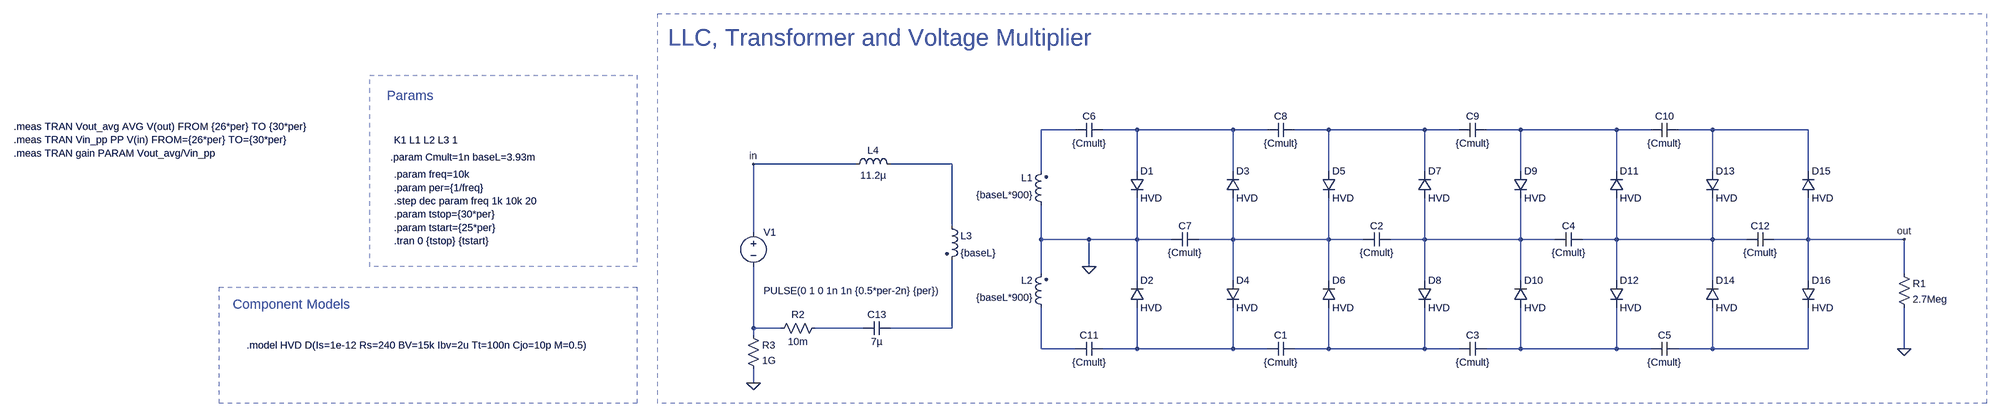
[diagram p0: schematic LLC_Multiplier.asc]
LLC_Multiplier.asc, the LTspice schematic file:
Version 4.1
SHEET 1 1636 1108
WIRE -496 -16 -576 -16
WIRE -352 -16 -432 -16
WIRE -128 -16 -352 -16
WIRE -48 -16 -128 -16
WIRE 96 -16 16 -16
WIRE 320 -16 96 -16
WIRE 400 -16 320 -16
WIRE 544 -16 464 -16
WIRE 768 -16 544 -16
WIRE 848 -16 768 -16
WIRE 992 -16 912 -16
WIRE 1216 -16 992 -16
WIRE -1008 64 -1248 64
WIRE -784 64 -928 64
WIRE -576 80 -576 -16
WIRE -352 80 -352 -16
WIRE -128 80 -128 -16
WIRE 96 80 96 -16
WIRE 320 80 320 -16
WIRE 544 80 544 -16
WIRE 768 80 768 -16
WIRE 992 80 992 -16
WIRE 1216 80 1216 -16
WIRE -784 208 -784 64
WIRE -1248 224 -1248 64
WIRE -576 240 -576 160
WIRE -464 240 -576 240
WIRE -352 240 -352 144
WIRE -352 240 -464 240
WIRE -272 240 -352 240
WIRE -128 240 -128 144
WIRE -128 240 -208 240
WIRE 96 240 96 144
WIRE 96 240 -128 240
WIRE 176 240 96 240
WIRE 320 240 320 144
WIRE 320 240 240 240
WIRE 544 240 544 144
WIRE 544 240 320 240
WIRE 624 240 544 240
WIRE 768 240 768 144
WIRE 768 240 688 240
WIRE 992 240 992 144
WIRE 992 240 768 240
WIRE 1072 240 992 240
WIRE 1216 240 1216 144
WIRE 1216 240 1136 240
WIRE 1440 240 1216 240
WIRE -464 304 -464 240
WIRE -576 320 -576 240
WIRE 1440 320 1440 240
WIRE -352 336 -352 240
WIRE -128 336 -128 240
WIRE 96 336 96 240
WIRE 320 336 320 240
WIRE 544 336 544 240
WIRE 768 336 768 240
WIRE 992 336 992 240
WIRE 1216 336 1216 240
WIRE -1248 448 -1248 304
WIRE -1184 448 -1248 448
WIRE -992 448 -1104 448
WIRE -784 448 -784 288
WIRE -784 448 -928 448
WIRE -1248 464 -1248 448
WIRE -576 496 -576 400
WIRE -496 496 -576 496
WIRE -352 496 -352 400
WIRE -352 496 -432 496
WIRE -128 496 -128 400
WIRE -128 496 -352 496
WIRE -48 496 -128 496
WIRE 96 496 96 400
WIRE 96 496 16 496
WIRE 320 496 320 400
WIRE 320 496 96 496
WIRE 400 496 320 496
WIRE 544 496 544 400
WIRE 544 496 464 496
WIRE 768 496 768 400
WIRE 768 496 544 496
WIRE 848 496 768 496
WIRE 992 496 992 400
WIRE 992 496 912 496
WIRE 1216 496 1216 400
WIRE 1216 496 992 496
WIRE 1440 496 1440 400
WIRE -1248 576 -1248 544
FLAG 1440 496 0
FLAG -464 304 0
FLAG -1248 64 in
FLAG 1440 240 out
FLAG -1248 576 0
SYMBOL cap 16 480 R90
WINDOW 0 0 32 VBottom 2
WINDOW 3 32 32 VTop 2
SYMATTR InstName C1
SYMATTR Value {Cmult}
SYMBOL cap 240 256 M270
WINDOW 0 32 32 VTop 2
WINDOW 3 0 32 VBottom 2
SYMATTR InstName C2
SYMATTR Value {Cmult}
SYMBOL cap 464 480 R90
WINDOW 0 0 32 VBottom 2
WINDOW 3 32 32 VTop 2
SYMATTR InstName C3
SYMATTR Value {Cmult}
SYMBOL res 1424 304 R0
SYMATTR InstName R1
SYMATTR Value 2.7Meg
SYMBOL cap 688 256 M270
WINDOW 0 32 32 VTop 2
WINDOW 3 0 32 VBottom 2
SYMATTR InstName C4
SYMATTR Value {Cmult}
SYMBOL cap 912 480 R90
WINDOW 0 0 32 VBottom 2
WINDOW 3 32 32 VTop 2
SYMATTR InstName C5
SYMATTR Value {Cmult}
SYMBOL cap -496 0 R270
WINDOW 0 32 32 VTop 2
WINDOW 3 0 32 VBottom 2
SYMATTR InstName C6
SYMATTR Value {Cmult}
SYMBOL cap -208 224 R90
WINDOW 0 0 32 VBottom 2
WINDOW 3 32 32 VTop 2
SYMATTR InstName C7
SYMATTR Value {Cmult}
SYMBOL cap 16 -32 R90
WINDOW 0 0 32 VBottom 2
WINDOW 3 32 32 VTop 2
SYMATTR InstName C8
SYMATTR Value {Cmult}
SYMBOL cap 464 -32 R90
WINDOW 0 0 32 VBottom 2
WINDOW 3 32 32 VTop 2
SYMATTR InstName C9
SYMATTR Value {Cmult}
SYMBOL cap 912 -32 R90
WINDOW 0 0 32 VBottom 2
WINDOW 3 32 32 VTop 2
SYMATTR InstName C10
SYMATTR Value {Cmult}
SYMBOL cap -496 512 R270
WINDOW 0 32 32 VTop 2
WINDOW 3 0 32 VBottom 2
SYMATTR InstName C11
SYMATTR Value {Cmult}
SYMBOL cap 1136 256 M270
WINDOW 0 32 32 VTop 2
WINDOW 3 0 32 VBottom 2
SYMATTR InstName C12
SYMATTR Value {Cmult}
SYMBOL ind2 -560 176 R180
WINDOW 0 36 80 Left 2
WINDOW 3 36 40 Left 2
SYMATTR InstName L1
SYMATTR Value {baseL*900}
SYMATTR Type ind
SYMBOL ind2 -560 416 R180
WINDOW 0 36 80 Left 2
WINDOW 3 36 40 Left 2
SYMATTR InstName L2
SYMATTR Value {baseL*900}
SYMATTR Type ind
SYMBOL ind2 -800 192 R0
SYMATTR InstName L3
SYMATTR Value {baseL}
SYMATTR Type ind
SYMATTR SpiceLine Rser=1
SYMBOL diode -368 80 R0
SYMATTR InstName D1
SYMATTR Value HVD
SYMBOL diode -368 400 M180
WINDOW 0 24 64 Left 2
WINDOW 3 24 0 Left 2
SYMATTR InstName D2
SYMATTR Value HVD
SYMBOL diode -144 144 M180
WINDOW 0 24 64 Left 2
WINDOW 3 24 0 Left 2
SYMATTR InstName D3
SYMATTR Value HVD
SYMBOL diode -144 336 R0
SYMATTR InstName D4
SYMATTR Value HVD
SYMBOL diode 80 80 R0
SYMATTR InstName D5
SYMATTR Value HVD
SYMBOL diode 80 400 M180
WINDOW 0 24 64 Left 2
WINDOW 3 24 0 Left 2
SYMATTR InstName D6
SYMATTR Value HVD
SYMBOL diode 304 144 M180
WINDOW 0 24 64 Left 2
WINDOW 3 24 0 Left 2
SYMATTR InstName D7
SYMATTR Value HVD
SYMBOL diode 304 336 R0
SYMATTR InstName D8
SYMATTR Value HVD
SYMBOL diode 528 80 R0
SYMATTR InstName D9
SYMATTR Value HVD
SYMBOL diode 528 400 M180
WINDOW 0 24 64 Left 2
WINDOW 3 24 0 Left 2
SYMATTR InstName D10
SYMATTR Value HVD
SYMBOL diode 752 144 M180
WINDOW 0 24 64 Left 2
WINDOW 3 24 0 Left 2
SYMATTR InstName D11
SYMATTR Value HVD
SYMBOL diode 752 336 R0
SYMATTR InstName D12
SYMATTR Value HVD
SYMBOL diode 976 80 R0
SYMATTR InstName D13
SYMATTR Value HVD
SYMBOL diode 976 400 M180
WINDOW 0 24 64 Left 2
WINDOW 3 24 0 Left 2
SYMATTR InstName D14
SYMATTR Value HVD
SYMBOL diode 1200 144 M180
WINDOW 0 24 64 Left 2
WINDOW 3 24 0 Left 2
SYMATTR InstName D15
SYMATTR Value HVD
SYMBOL diode 1200 336 R0
SYMATTR InstName D16
SYMATTR Value HVD
SYMBOL ind -1024 80 R270
WINDOW 0 32 56 VTop 2
WINDOW 3 5 56 VBottom 2
SYMATTR InstName L4
SYMATTR Value 11.2µ
SYMBOL cap -928 432 R90
WINDOW 0 0 32 VBottom 2
WINDOW 3 32 32 VTop 2
SYMATTR InstName C13
SYMATTR Value 7µ
SYMBOL res -1088 432 R90
WINDOW 0 0 56 VBottom 2
WINDOW 3 32 56 VTop 2
SYMATTR InstName R2
SYMATTR Value 10m
SYMBOL voltage -1248 208 R0
WINDOW 3 24 152 Left 2
WINDOW 123 0 0 Left 0
WINDOW 39 0 0 Left 0
SYMATTR InstName V1
SYMATTR Value PULSE(0 1 0 1n 1n {0.5*per-2n} {per})
SYMBOL res -1264 448 R0
SYMATTR InstName R3
SYMATTR Value 1G
TEXT -1448 -232 Left 5 ;LLC, Transformer and Voltage Multiplier
TEXT -2088 8 Left 2 !K1 L1 L2 L3 1
TEXT -2096 48 Left 2 !.param Cmult=1n baseL=3.93m
TEXT -2432 488 Left 2 !.model HVD D(Is=1e-12 Rs=240 BV=15k Ibv=2u Tt=100n Cjo=10p M=0.5)
TEXT -2104 -96 Left 3 ;Params
TEXT -2464 392 Left 3 ;Component Models
TEXT -2088 88 Left 2 !.param freq=10k\n.param per={1/freq}\n.step dec param freq 1k 10k 20\n.param tstop={30*per}\n.param tstart={25*per}\n.tran 0 {tstop} {tstart}
TEXT -2976 -24 Left 2 !.meas TRAN Vout_avg AVG V(out) FROM {26*per} TO {30*per}\n.meas TRAN Vin_pp PP V(in) FROM={26*per} TO={30*per}\n.meas TRAN gain PARAM Vout_avg/Vin_pp
RECTANGLE Normal 1632 624 -1472 -288 1
RECTANGLE Normal -1520 304 -2144 -144 1
RECTANGLE Normal -1520 624 -2496 352 1

The netlist it stands for:
* LLC_Multiplier.asc
C1 N015 N014 {Cmult}
C2 N008 N007 {Cmult}
C3 N016 N015 {Cmult}
R1 out 0 2.7Meg
C4 N009 N008 {Cmult}
C5 N017 N016 {Cmult}
C6 N001 N002 {Cmult}
C7 N007 0 {Cmult}
C8 N003 N002 {Cmult}
C9 N004 N003 {Cmult}
C10 N005 N004 {Cmult}
C11 N013 N014 {Cmult}
C12 out N009 {Cmult}
L1 0 N001 {baseL*900}
L2 N013 0 {baseL*900}
L3 N006 N012 {baseL} Rser=1
D1 N002 0 HVD
D2 N014 0 HVD
D3 N007 N002 HVD
D4 N007 N014 HVD
D5 N003 N007 HVD
D6 N015 N007 HVD
D7 N008 N003 HVD
D8 N008 N015 HVD
D9 N004 N008 HVD
D10 N016 N008 HVD
D11 N009 N004 HVD
D12 N009 N016 HVD
D13 N005 N009 HVD
D14 N017 N009 HVD
D15 out N005 HVD
D16 out N017 HVD
L4 in N006 11.2µ
C13 N012 N011 7µ
R2 N011 N010 10m
V1 in N010 PULSE(0 1 0 1n 1n {0.5*per-2n} {per})
R3 N010 0 1G
.model D D
.lib standard.dio
* LLC, Transformer and Voltage Multiplier
K1 L1 L2 L3 1
.param Cmult=1n baseL=3.93m
.model HVD D(Is=1e-12 Rs=240 BV=15k Ibv=2u Tt=100n Cjo=10p M=0.5)
* Params
* Component Models
.param freq=10k
.param per={1/freq}
.step dec param freq 1k 10k 20
.param tstop={30*per}
.param tstart={25*per}
.tran 0 {tstop} {tstart}
.meas TRAN Vout_avg AVG V(out) FROM {26*per} TO {30*per}
.meas TRAN Vin_pp PP V(in) FROM={26*per} TO={30*per}
.meas TRAN gain PARAM Vout_avg/Vin_pp
.backanno
.end